# Altium schematic sheet Mikeduino Schematic Diagram.SchDoc
size A2; DocumentNumber: 6; SheetNumber: 6; SheetTotal: 6
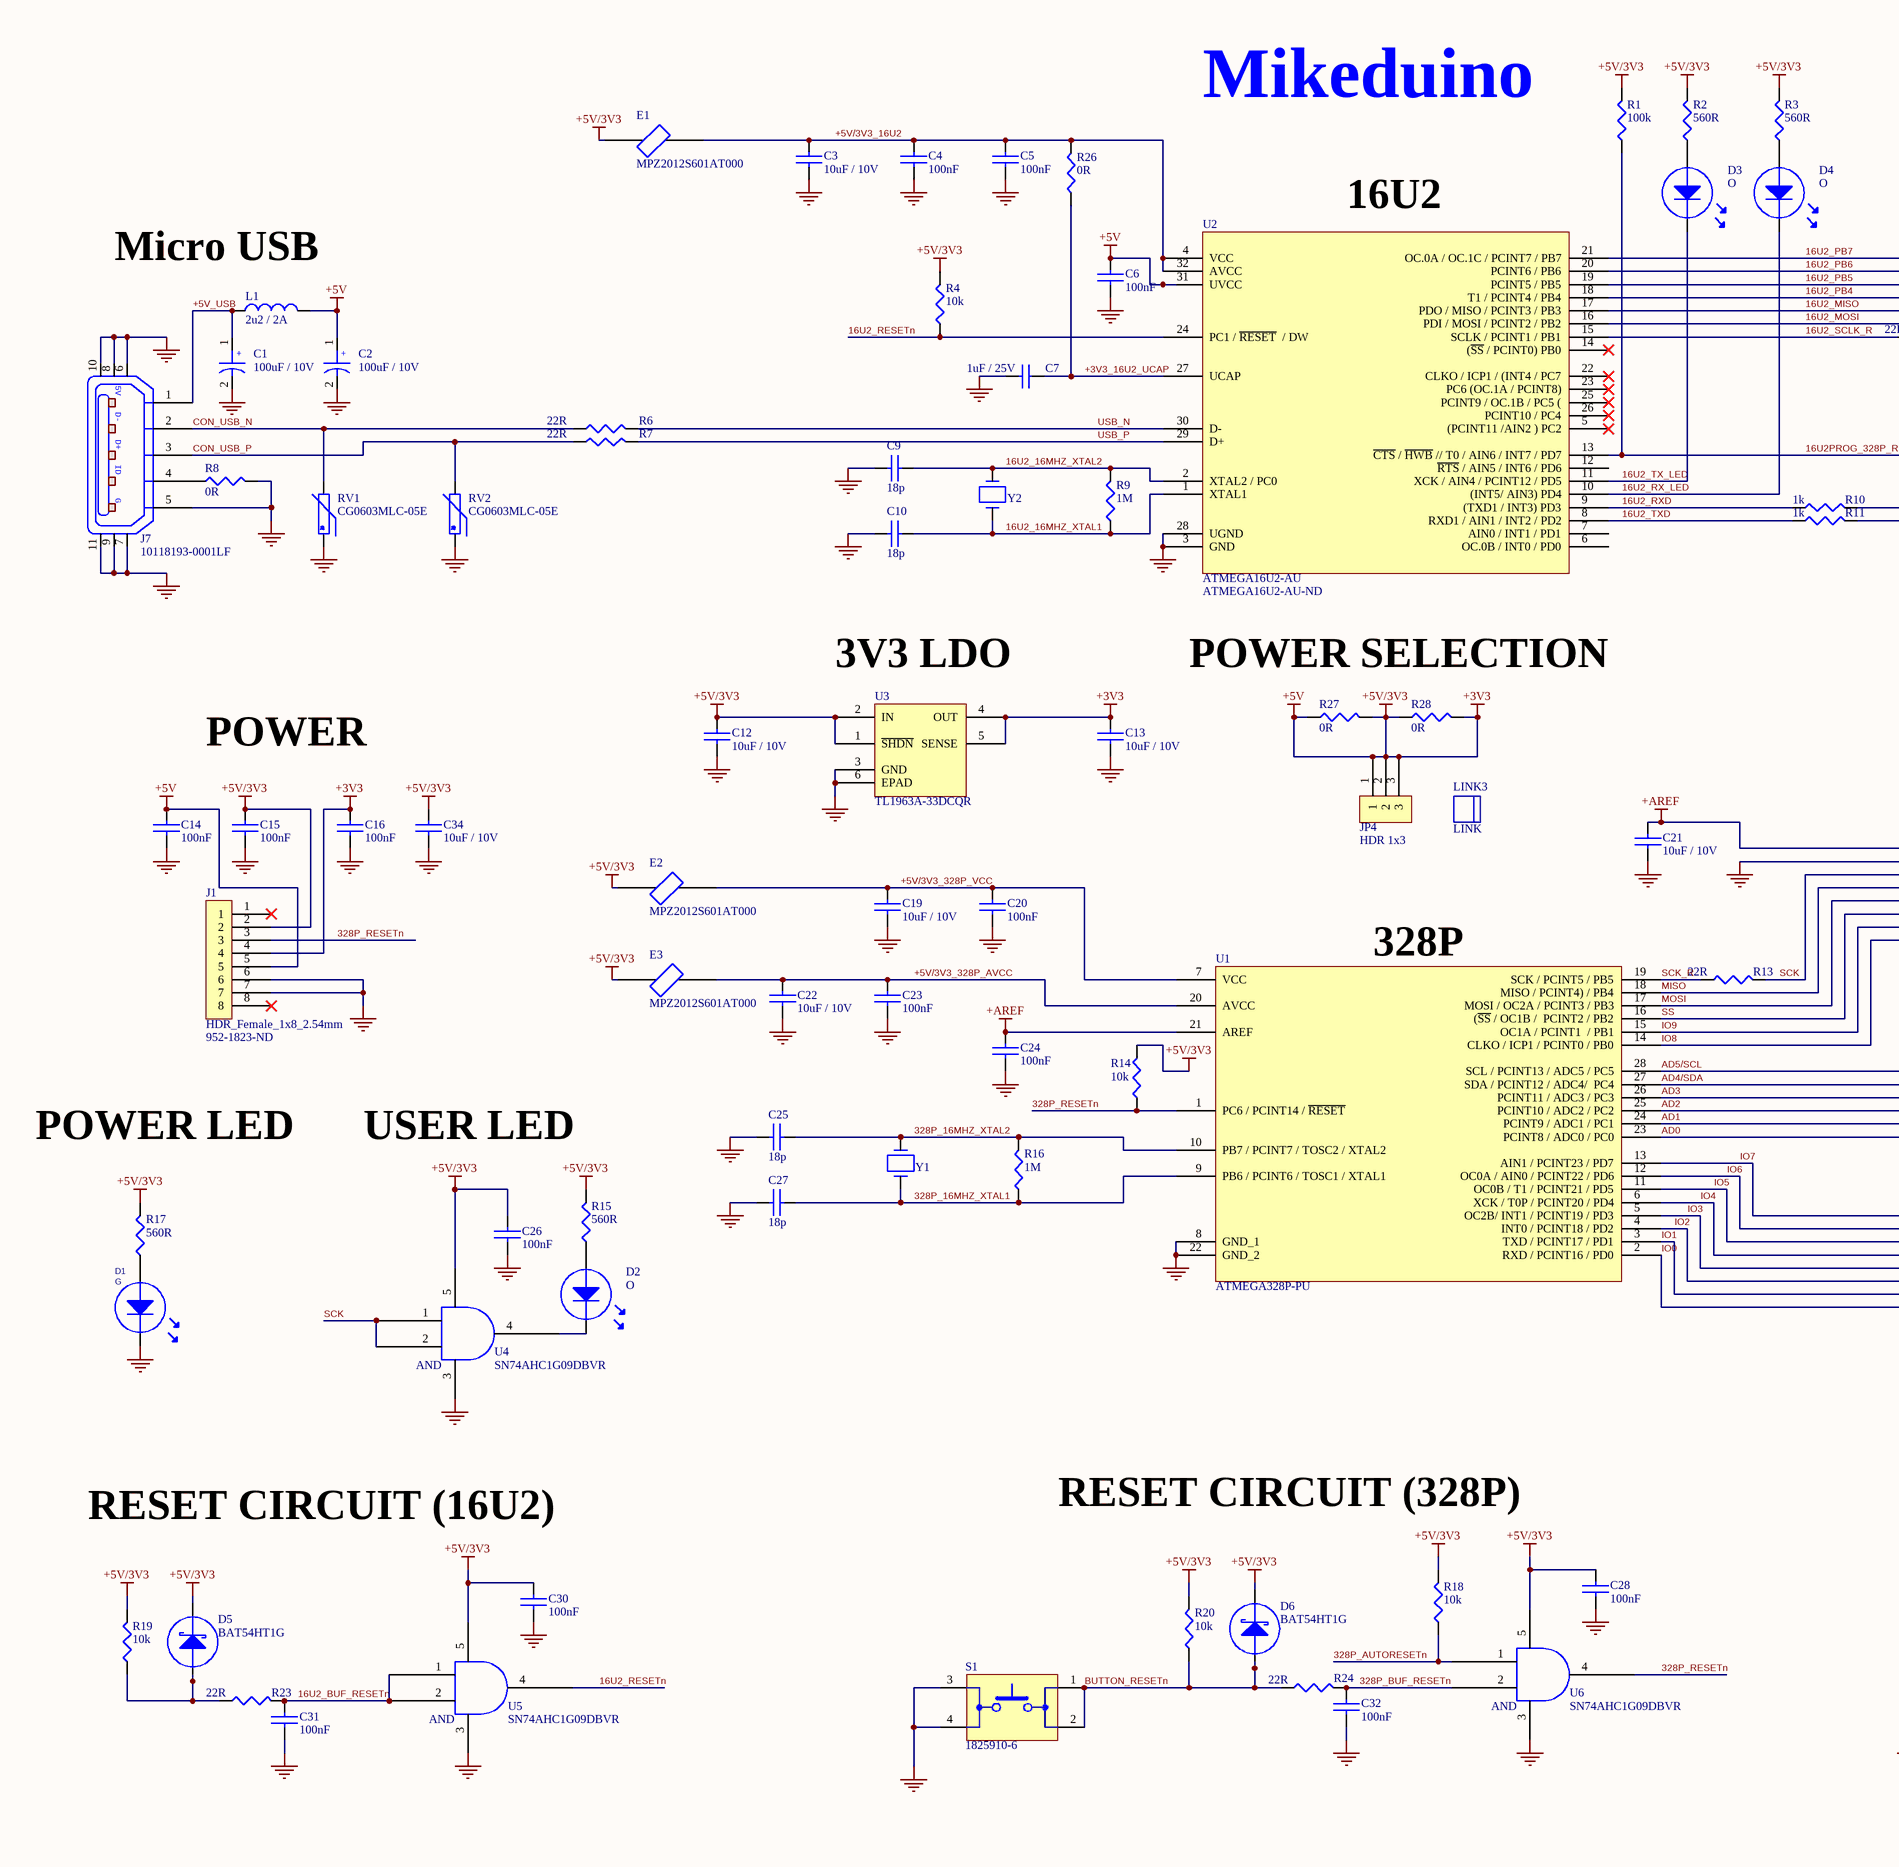
[diagram p0: Mikeduino Schematic Diagram.SchDoc, left]
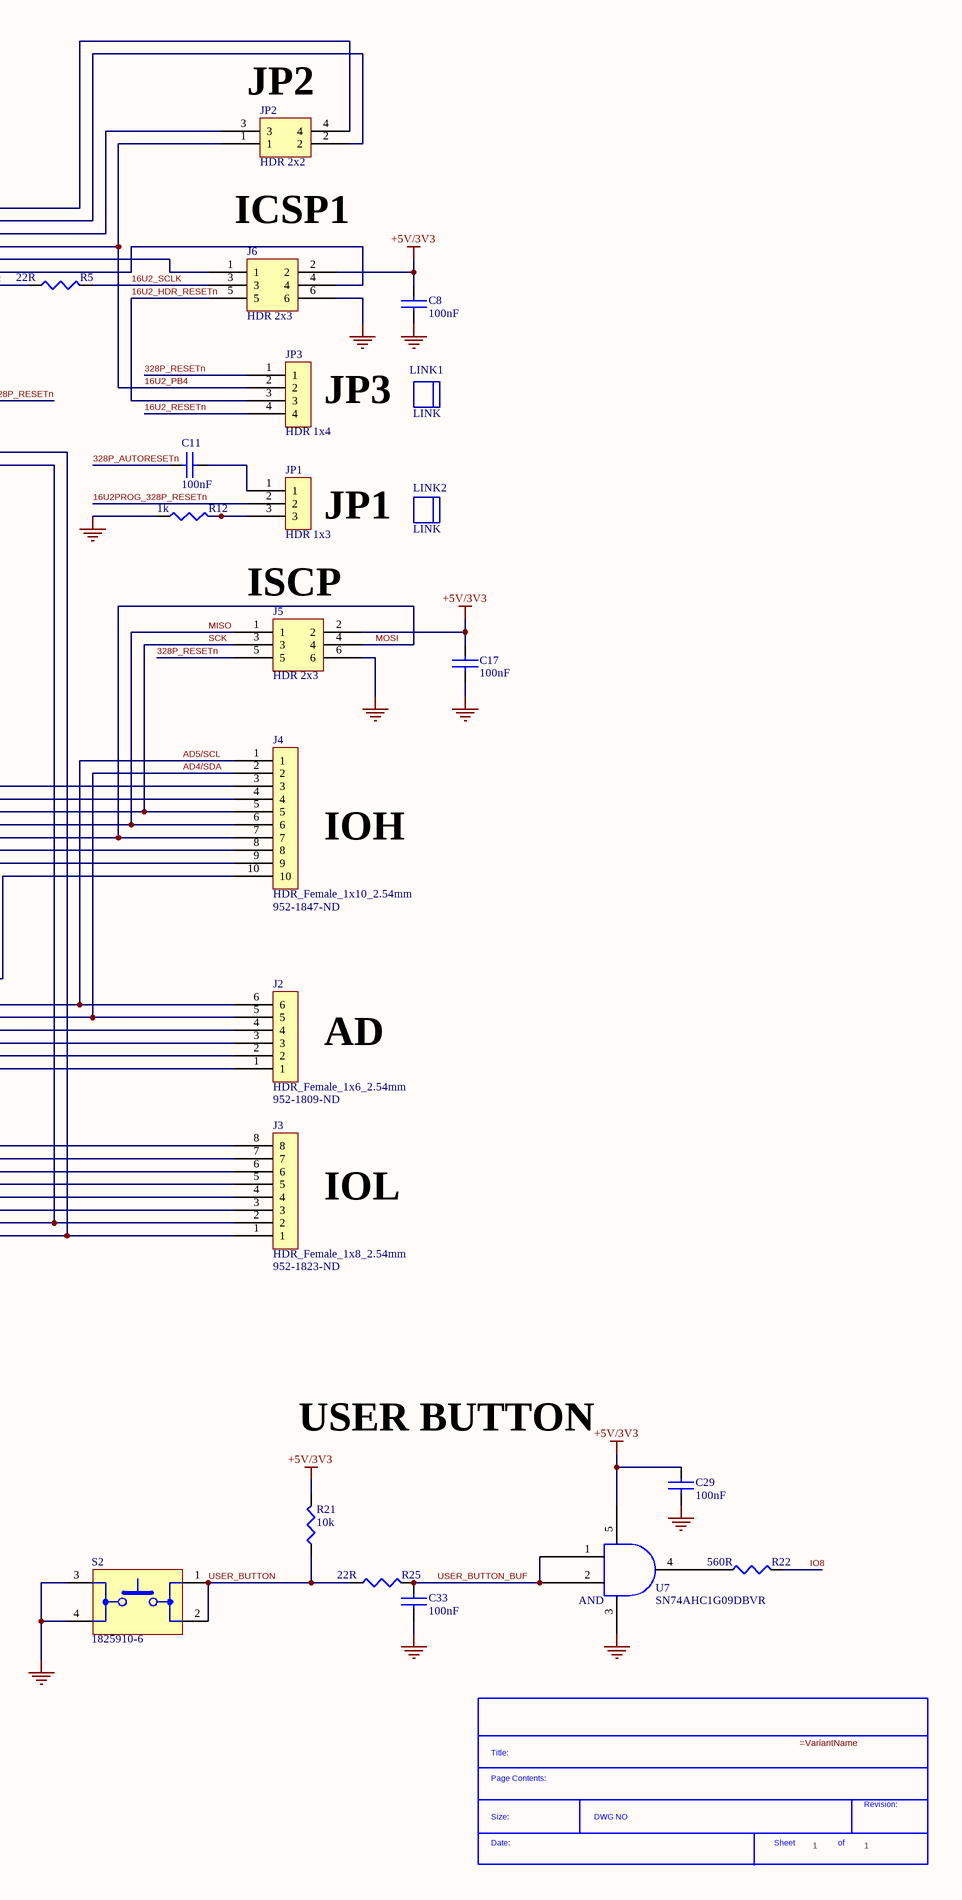
[diagram p1: Mikeduino Schematic Diagram.SchDoc, right]

## Parts
*?  SDTitleBlock  (value not drawn)  (graphical)
C1  100uF / 10V  [C_ALU]
C2  100uF / 10V  [C_ALU]
C3  10uF / 10V  [C0805]
C4  100nF  [C0805]
C5  100nF  [C0805]
C6  100nF  [C0805]
C7  1uF / 25V  [C0805]
C8  100nF  [C0805]
C9  18p  [C0805]
C10  18p  [C0805]
C11  100nF  [C0805]
C12  10uF / 10V  [C0805]
C13  10uF / 10V  [C0805]
C14  100nF  [C0805]
C15  100nF  [C0805]
C16  100nF  [C0805]
C17  100nF  [C0805]
C19  10uF / 10V  [C0805]
C20  100nF  [C0805]
C21  10uF / 10V  [C0805]
C22  10uF / 10V  [C0805]
C23  100nF  [C0805]
C24  100nF  [C0805]
C25  18p  [C0805]
C26  100nF  [C0805]
C27  18p  [C0805]
C28  100nF  [C0805]
C29  100nF  [C0805]
C30  100nF  [C0805]
C31  100nF  [C0805]
C32  100nF  [C0805]
C33  100nF  [C0805]
C34  10uF / 10V  [C0805]
D1  G  [LED_0603]
D2  O  [LED_0603]
D3  O  [LED_0603]
D4  O  [LED_0603]
D5  BAT54HT1G  [SOD323]
D6  BAT54HT1G  [SOD323]
E1  MPZ2012S601AT000  [C0805]
E2  MPZ2012S601AT000  [C0805]
E3  MPZ2012S601AT000  [C0805]
J1  HDR_Female_1x8_2.54mm  Supplier Part Number 1: 952-1823-ND  [HDR_Female_1x8_2.54mm - duplicate]
J2  HDR_Female_1x6_2.54mm  Supplier Part Number 1: 952-1809-ND  [HDR_Female_1x6_2.54mm]
J3  HDR_Female_1x8_2.54mm  Supplier Part Number 1: 952-1823-ND  [HDR_Female_1x8_2.54mm - duplicate]
J4  HDR_Female_1x10_2.54mm  Supplier Part Number 1: 952-1847-ND  [HDR_Female_1x10_2.54mm - duplicate]
J5  HDR 2x3  [HDR_2x3_2.54MM]
J6  HDR 2x3  [HDR_2x3_2.54MM]
J7  10118193-0001LF  [10118193]
JP1  HDR 1x3  [Hdr_1x3_2.54mm]
JP2  HDR 2x2  [HDR_2x2_2.54MM]
JP3  HDR 1x4  [HDR_1x4_2.54MM]
JP4  HDR 1x3  [Hdr_1x3_2.54mm]
L1  2u2 / 2A  [C1210_IND]
LINK1  LINK  (mechanical)
LINK2  LINK  (mechanical)
LINK3  LINK  (mechanical)
R1  100k  [R0805]
R2  560R  [R0805]
R3  560R  [R0805]
R4  10k  [R0805]
R5  22R  [R0805]
R6  22R  [R0805]
R7  22R  [R0805]
R8  0R  [R0805]
R9  1M  [R0805]
R10  1k  [R0805]
R11  1k  [R0805]
R12  1k  [R0805]
R13  22R  [R0805]
R14  10k  [R0805]
R15  560R  [R0805]
R16  1M  [R0805]
R17  560R  [R0805]
R18  10k  [R0805]
R19  10k  [R0805]
R20  10k  [R0805]
R21  10k  [R0805]
R22  560R  [R0805]
R23  22R  [R0805]
R24  22R  [R0805]
R25  22R  [R0805]
R26  0R  [R0805]
R27  0R  [R0805]
R28  0R  [R0805]
RV1  CG0603MLC-05E  [R0603]
RV2  CG0603MLC-05E  [R0603]
S1  1825910-6  [1825910-6]
S2  1825910-6  [1825910-6]
U1  ATMEGA328P-PU  [28PIN_DIP_7.62mm]
U2  ATMEGA16U2-AU  Supplier Part Number 1: ATMEGA16U2-AU-ND  [TQFP32]
U3  TL1963A-33DCQR  [DCQ (R-PDSO-G6)]
U4  SN74AHC1G09DBVR  [DBV_SOT_23_5]
U5  SN74AHC1G09DBVR  [DBV_SOT_23_5]
U6  SN74AHC1G09DBVR  [DBV_SOT_23_5]
U7  SN74AHC1G09DBVR  [DBV_SOT_23_5]
Y1  ABM7-22.1184MHZ-D2Y-T  [ABM7_v1_1_BIG]  (value not drawn)
Y2  ABM7-22.1184MHZ-D2Y-T  [ABM7_v1_1_BIG]  (value not drawn)

## Nets
+3V3: C2.1 C6.2 C8.2 C12.2 C13.2 C14.2 C15.2 C16.2 C17.2 C26.2 C28.2 C29.2 C30.2 C34.2 D5.1(CATHODE) D6.1(CATHODE) E1.1 E2.1 E3.1 J1.2 J1.4 J1.5 J5.2 J6.2 JP4.1 JP4.2 JP4.3 L1.2 R1.2 R2.2 R3.2 R4.2 R14.2 R15.2 R17.2 R18.2 R19.2 R20.2 R21.2 R27.1 R27.2 R28.1 R28.2 U2.31(UVCC) U3.1(~{SHDN}) U3.2(IN) U3.4(OUT) U3.5(SENSE) U4.5(VCC) U5.5(VCC) U6.5(VCC) U7.5(VCC)  [also labelled +5V, +5V/3V3]
+AREF: C21.2 C24.2 J4.3 U1.21(AREF)
GND: C1.2 C2.2 C3.1 C4.1 C5.1 C6.1 C7.2 C8.1 C9.1 C10.1 C12.1 C13.1 C14.1 C15.1 C16.1 C17.1 C19.1 C20.1 C21.1 C22.1 C23.1 C24.1 C25.1 C26.1 C27.1 C28.1 C29.1 C30.1 C31.1 C32.1 C33.1 C34.1 D1.1(cathode) J1.6 J1.7 J4.4 J5.6 J6.6 J7.5(P5) J7.6 J7.7 J7.8 J7.9 J7.10 J7.11 R8.2 R12.1 RV1.1 RV2.1 S1.3(MECH1) S1.4(MECH2) S2.3(MECH1) S2.4(MECH2) U1.8(GND_1) U1.22(GND_2) U2.3(GND) U2.28(UGND) U3.3(GND) U3.6(EPAD) U4.3(GND) U5.3(GND) U6.3(GND) U7.3(GND)
16U2_16MHZ_XTAL1: C10.2 R9.1 U2.1(XTAL1) Y2.1
16U2_16MHZ_XTAL2: C9.2 R9.2 U2.2(XTAL2_/_PC0) Y2.2
16U2_BUF_RESETn: C31.2 R23.2 U5.1(A) U5.2(B)
16U2_HDR_RESETn: J6.5 JP3.3
16U2_MISO: J6.1 U2.17(PDO_/_MISO_/_PCINT3_/_PB3)
16U2_MOSI: J6.4 U2.16(PDI_/_MOSI_/_PCINT2_/_PB2)
16U2_PB4: JP2.1 JP3.2 U2.18(T1_/_PCINT4_/_PB4)
16U2_PB5: JP2.3 U2.19(PCINT5_/_PB5)
16U2_PB6: JP2.2 U2.20(PCINT6_/_PB6)
16U2_PB7: JP2.4 U2.21(OC.0A_/_OC.1C_/_PCINT7_/_PB7)
16U2_RESETn: JP3.4 R4.1 U2.24(PC1_/_~{RESET}__/_DW) U5.4(Y)
16U2_RX_LED: D4.1(cathode) U2.10((INT5/_AIN3)_PD4)
16U2_RXD: R10.1 U2.9((TXD1_/_INT3)_PD3)
16U2_SCLK: J6.3 R5.2
16U2_SCLK_R: R5.1 U2.15(SCLK_/_PCINT1_/_PB1)
16U2_TX_LED: D3.1(cathode) U2.11(XCK_/_AIN4_/_PCINT12_/_PD5)
16U2_TXD: R11.1 U2.8(RXD1_/_AIN1_/_INT2_/_PD2)
16U2PROG_328P_RESETn: JP1.2 R1.1 U2.13(~{CTS}_/_~{HWB}_//_T0_/_AIN6_/_INT7_/_PD7)
328P_16MHZ_XTAL1: C27.2 R16.1 U1.9(PB6_/_PCINT6_/_TOSC1_/_XTAL1) Y1.1
328P_16MHZ_XTAL2: C25.2 R16.2 U1.10(PB7_/_PCINT7_/_TOSC2_/_XTAL2) Y1.2
328P_AUTORESETn: C11.1 R18.1 U6.1(A)
328P_BUF_RESETn: C32.2 R24.2 U6.2(B)
328P_RESETn: J1.3 J5.5 JP3.1 R14.1 U1.1(PC6_/_PCINT14_/_~{RESET}) U6.4(Y)
+3V3_16U2_UCAP: C7.1 R26.1 U2.27(UCAP)
+5V/3V3_16U2: C3.2 C4.2 C5.2 E1.2 R26.2 U2.4(VCC) U2.32(AVCC)
+5V/3V3_328P_AVCC: C22.2 C23.2 E3.2 U1.20(AVCC)
+5V/3V3_328P_VCC: C19.2 C20.2 E2.2 U1.7(VCC)
+5V_USB: C1.1 J7.1(P1) L1.1
AD0: J2.1 U1.23(PCINT8_/_ADC0_/_PC0)
AD1: J2.2 U1.24(PCINT9_/_ADC1_/_PC1)
AD2: J2.3 U1.25(PCINT10_/_ADC2_/_PC2)
AD3: J2.4 U1.26(PCINT11_/_ADC3_/_PC3)
AD4/SDA: J2.5 J4.2 U1.27(SDA_/_PCINT12_/_ADC4/__PC4)
AD5/SCL: J2.6 J4.1 U1.28(SCL_/_PCINT13_/_ADC5_/_PC5)
BUTTON_RESETn: D6.2(ANODE) R20.1 R24.1 S1.1 S1.2
CON_USB_N: J7.2(P2) R6.1 RV1.2
CON_USB_P: J7.3(P3) R7.1 RV2.2
IO0: J3.1 R10.2 U1.2(RXD_/_PCINT16_/_PD0)
IO1: J3.2 R11.2 U1.3(TXD_/_PCINT17_/_PD1)
IO2: J3.3 U1.4(INT0_/_PCINT18_/_PD2)
IO3: J3.4 U1.5(OC2B/_INT1_/_PCINT19_/_PD3)
IO4: J3.5 U1.6(XCK_/_T0P_/_PCINT20_/_PD4)
IO5: J3.6 U1.11(OC0B_/_T1_/_PCINT21_/_PD5)
IO6: J3.7 U1.12(OC0A_/_AIN0_/_PCINT22_/_PD6)
IO7: J3.8 U1.13(AIN1_/_PCINT23_/_PD7)
IO8: J4.10 R22.2 U1.14(CLKO_/_ICP1_/_PCINT0_/_PB0)
IO9: J4.9 U1.15(OC1A_/_PCINT1__/_PB1)
MISO: J4.6 J5.1 U1.18(MISO_/_PCINT4)_/_PB4)
MOSI: J4.7 J5.4 U1.17(MOSI_/_OC2A_/_PCINT3_/_PB3)
SCK: J4.5 J5.3 R13.2 U4.1(A) U4.2(B)
SCK_R: R13.1 U1.19(SCK_/_PCINT5_/_PB5)
SS: J4.8 U1.16((~{SS}_/_OC1B_/__PCINT2_/_PB2)
USB_N: R6.2 U2.30(D-)
USB_P: R7.2 U2.29(D+)
USER_BUTTON: R21.1 R25.1 S2.1 S2.2
USER_BUTTON_BUF: C33.2 R25.2 U7.1(A) U7.2(B)
NetC11_2: C11.2 JP1.1
NetD1_2: D1.2(ANODE) R17.1
NetD2_1: D2.1(cathode) U4.4(Y)
NetD2_2: D2.2(ANODE) R15.1
NetD3_2: D3.2(ANODE) R2.1
NetD4_2: D4.2(ANODE) R3.1
NetD5_2: D5.2(ANODE) R19.1 R23.1
NetJ7_4: J7.4(P4) R8.1
NetJP1_3: JP1.3 R12.2
NetR22_1: R22.1 U7.4(Y)

Not connected (* = marked no-connect by the designer): J1 1* 8*; U2 5((PCINT11_/AIN2_)_PC2)* 6(OC.0B_/_INT0_/_PD0) 7(AIN0_/_INT1_/_PD1) 12(~{RTS}_/_AIN5_/_INT6_/_PD6) 14((~{SS}_/_PCINT0)_PB0)* 22(CLKO_/_ICP1_/_(INT4_/_PC7)* 23(PC6_(OC.1A_/_PCINT8))* 25(PCINT9_/_OC.1B_/_PC5_()* 26(PCINT10_/_PC4)*

## Notes on the sheet
- Mikeduino
- (near JP2) JP2
- (near U2) 16U2
- (near L1) Micro USB
- ICSP1
- JP3
- JP1
- (near U3) 3V3 LDO
- POWER SELECTION
- (near J5) ISCP
- POWER
- (near U1) 328P
- IOH
- POWER LED
- USER LED
- AD
- IOL
- RESET CIRCUIT (16U2)
- RESET CIRCUIT (328P)
- USER BUTTON
- Labels drawn without touching a wire or pin: 1, =VariantName
- (in symbol 10118193-0001LF) 5V; D-; D+; ID; G
- (in symbol EEA-GA1A101B) +
- (in symbol SDTitleBlock) Title:; Page Contents:; Revision:; Size:; DWG NO; Date:; Sheet; of
- (in symbol SN74AHC1G09DBVR) AND

## Library data of the parts
C1 C2 = EEA-GA1A101B: CAP ALUM 100UF 20% 10V RADIAL; Manufacturer: Panasonic; Ripple Current: 110mA; Life (Hours): 1000Hour; Leakage Current: 10uA; Supplier 1: Digi-Key; Manufacturer Part Number 1: EEA-GA1A101B; Description 1: CAP ALUM 100UF 20% 10V RADIAL; Stock 1: 5678; Pricing 1: 1=0.35, 10=0.238, 100=0.1347, 500=0.0951, 1000=0.0832 (USD); Mount: Through Hole; Case/Package: Radial; Contact Plating: Tin; Min Operating Temperature: -55°C; Max Operating Temperature: 105°C; Package Quantity: 1; Capacitance: 100uF; Tolerance: 20%; Packaging: Tape and Reel; Voltage Rating: 10V; Voltage Rating (DC): 10V; Termination: Radial; Features: General Purpose; Diameter: 6.3mm; Length: 7mm; Height: 7mm; Lead Pitch: 5mm; Height - Seated (Max): 0.276inch; Radiation Hardening: No; Supplier Part Number 1: P15782CT-ND
C3 C12 C13 C19 C21 C22 C34 = CL21A106KPCLQNC: Cap Ceramic 10uF 10V X5R 10% SMD 0805 85C Cardboard T/R; Manufacturer: Samsung; Supplier 1: Digi-Key; Manufacturer Part Number: CL21A106KPCLQNC; Stock 1: 40000; Pricing 1: 1=0.23, 10=0.16, 100=0.0811, 500=0.0555, 1000=0.0491 (USD); Mount: Surface Mount; Case/Package: 0805; Case Code (Metric): 2012; Case Code (Imperial): 0805; Contact Plating: Tin; Min Operating Temperature: -55°C; Max Operating Temperature: 85°C; Tolerance: 10%; Capacitance: 10uF; Dielectric: X5R; Packaging: Tape and Reel; Package Quantity: 1; Voltage Rating: 10V; Length: 2mm; Height: 0.85mm; Depth: 1.25mm; Width: 0.049inch; Thickness: 0.037inch; Radiation Hardening: No; Supplier Part Number 1: 1276-2402-6-ND
C4-C6 C8 C11 C14-C17 C20 C23 C24 C26 C28-C33 = CEU4J2X7R1H104K125AE: TDK         CEU4J2X7R1H104K125AE             SMD Multilayer Ceramic Capacitor, 0805 [2012 Metric], 0.1 F, 50 V,  10%, X7R, CEU Series; Voltage Rating: 50V; Supplier 1: Digi-Key; Manufacturer: TDK; Manufacturer Part Number: CEU4J2X7R1H104K125AE; Stock 1: 0; Pricing 1: 2000=0.108 (USD); Mount: Surface Mount; Case/Package: 0805; Weight: 0.000194oz; Case Code (Imperial): 0805; Case Code (Metric): 2012; Min Operating Temperature: -55°C; Max Operating Temperature: 125°C; Capacitance: 100nF; Tolerance: 10%; Packaging: Tape and Reel; Dielectric: X7R; Termination: SMD/SMT; Voltage Rating (DC): 50V; Package Quantity: 1; Composition: Ceramic; Length: 2mm; Width: 1.2mm; Thickness: 0.057inch; Depth: 1.25mm; REACH SVHC: No SVHC; ComponentLink1URL: https://datasheet.ciiva.com/24219/ceu4j2x7r1h104k125ae-265602-24219969.pdf; ComponentLink1Description: https://datasheet.ciiva.com/24219/ceu4j2x7r1h104k125ae-265602-24219969.pdf; ComponentLink2URL: https://datasheet.ciiva.com/6257/tdk-tj-car-e-0711-6257705.pdf; ComponentLink2Description: https://datasheet.ciiva.com/6257/tdk-tj-car-e-0711-6257705.pdf; ComponentLink3URL: https://datasheet.ciiva.com/6257/tdk-tj-car-e-0711-6257707.pdf; ComponentLink3Description: https://datasheet.ciiva.com/6257/tdk-tj-car-e-0711-6257707.pdf; ComponentLink4URL: https://datasheet.ciiva.com/6257/tdk-tj-car-e-0711-6257710.pdf; ComponentLink4Description: https://datasheet.ciiva.com/6257/tdk-tj-car-e-0711-6257710.pdf; Supplier Part Number 1: 445-7856-2-ND
C7 = C2012X5R1E105K125AA: CAP CER 1UF 25V 10% X5R 0805; Manufacturer: TDK Corporation; Capacitance: 1µF; .Creator: MM; .Checked PCB: RF; Supplier 1: Digi-Key; Manufacturer Part Number: C2012X5R1E105K125AA; RoHS: RoHS Compliant; Category: Capacitors; Stock 1: 57052; Pricing 1: 1=0.16, 10=0.112, 100=0.0533, 250=0.04488, 500=0.03758, 1000=0.03025 (USD); Packaging: Cut Tape (CT); Tolerance: ±10%; Voltage - Rated: 25V; Temperature Coefficient: X5R; Mounting Type: Surface Mount, MLCC; Operating Temperature: -55°C ~ 85°C; Applications: General Purpose; Ratings: -; Package / Case: 0805 (2012 Metric); Size / Dimension: 0.079" L x 0.049" W (2.00mm x 1.25mm); Height - Seated (Max): -; Thickness (Max): 0.057" (1.45mm); Lead Spacing: -; Features: -; Lead Style: -; ComponentLink1URL: http://product.tdk.com/en/catalog/datasheets/mlcc_commercial_general_en.pdf; ComponentLink1Description: http://product.tdk.com/en/catalog/datasheets/mlcc_commercial_general_en.pdf; Supplier Part Number 1: 445-1419-1-ND; .Checked SCH: RF
C9 C10 C25 C27 = C0805C180J5GAC7800: KEMET 18pF Multilayer Ceramic Capacitor (MLCC) 50 V dc 5% C0G dielectric C SMD max op. temp. +125C; Voltage: 50V; Temperature Coefficient: 30ppm/°C; Supplier 1: Digi-Key; Manufacturer: KEMET; Manufacturer Part Number 1: C0805C180J5GAC7800; Description 1: KEMET 18pF Multilayer Ceramic Capacitor (MLCC) 50 V dc 5% C0G dielectric C SMD max op. temp. +125C; Stock 1: 0; Pricing 1: 1=0.16, 10=0.113, 100=0.0532, 500=0.0373, 1000=0.0309 (USD); Mount: Surface Mount; Case/Package: 0805; Dielectric Material: Ceramic; Contact Plating: Matte,Tin; Min Operating Temperature: -55°C; Max Operating Temperature: 125°C; Tolerance: 5%; Capacitance: 18pF; Packaging: Tape and Reel; Dielectric: C0G; Termination: SMD/SMT; Voltage Rating (DC): 50V; Length: 2mm; Height: 0.78mm; Depth: 1.25mm; Radiation Hardening: No; Lead Free: Lead Free; Supplier Part Number 1: 399-1112-6-ND
D1 = LG L29K-G2J1-24-Z: LED SMARTLED GREEN 570NM 0603; Manufacturer: OSRAM Opto Semiconductors Inc; .Checked PCB: used; Current - Test: 2mA; Voltage - Forward (Vf) Typ: 1.7V; Luminous Flux @ Current - Test: 12 mlm; Millicandela Rating: 3.92mcd; Wavelength - Peak: 572nm; Lens Type: Diffused; Lens Style/Size: Rectangle with Flat Top, 1.3mm x 0.8mm; Viewing Angle: 160°; Regulator Topology: Positive Fixed; Voltage - Output: 2.5V; Voltage - Input: 2.6 V ~ 6 V; Voltage - Dropout (Typical): 0.16V @ 500mA; Number of Regulators: 1; Current - Output: 500mA; Current - Limit (Min): 600mA; .Checked SCH: used; Category: Optoelectronics; Supplier Part Number: 475-2709-1-ND; Family: LEDs - <75mA, Discre; Manufacturer Part Number: LG L29K-G2J1-24-Z; Price 1k [$]: 0.08744; Value: Green; Color: Green; Package / Case: 0603 (1608 Metric); Supplier: Digikey; Supplier 1: Digi-Key; Supplier Part Number 1: 475-2709-1-ND; RoHS: RoHS Compliant; Stock 1: 30318; Pricing 1: 1=0.16, 10=0.137, 100=0.1093, 250=0.09564, 500=0.08744 (USD); Wavelength - Dominant: 570nm; Size / Dimension: 1.70mm L x 0.80mm W; Height: 0.65mm; Mounting Type: Surface Mount; Packaging: Cut Tape (CT); ComponentLink1URL: http://catalog.osram-os.com/catalogue/catalogue.do;jsessionid=32CB61882C089EDD4B6D0A54E7E1F117?act=downloadFile&favOid=020000020000138e000100b6; ComponentLink1Description: http://catalog.osram-os.com/catalogue/catalogue.do;jsessionid=32CB61882C089EDD4B6D0A54E7E1F117?act=downloadFile&favOid=020000020000138e000100b6; Operating Temperature: -40°C ~ 125°C; Supplier Device Package: 6-TMLF® (1.6x1.6); ComponentLink2URL: http://www.micrel.com/_PDF/mic5353.pdf; ComponentLink2Description: http://www.micrel.com/_PDF/mic5353.pdf
D2-D4 = LO L29K-H2K1-24-Z: LED SMARTLED ORANGE 606NM 0603; Manufacturer: OSRAM Opto Semiconductors Inc; Millicandela Rating: 6.3mcd; Voltage - Forward (Vf) Typ: 1.8V; Current - Test: 2mA; Wavelength - Peak: 610nm; Viewing Angle: 160°; Lens Type: Diffused; Lens Style/Size: Rectangle with Flat Top, 1.3mm x 0.8mm; Luminous Flux @ Current - Test: 25 mlm; .Checked PCB: used; Supplier 1: Digi-Key; Supplier Part Number 1: 475-2740-1-ND; Manufacturer Part Number: LO L29K-H2K1-24-Z; RoHS: RoHS Compliant; Category: Optoelectronics; Stock 1: 15900; Pricing 1: 1=0.17, 10=0.141, 100=0.1127, 250=0.0986, 500=0.09016 (USD); Color: Orange; Wavelength - Dominant: 606nm; Package / Case: 0603 (1608 Metric); Size / Dimension: 1.70mm L x 0.80mm W; Height: 0.65mm; Mounting Type: Surface Mount; Packaging: Cut Tape (CT); ComponentLink1URL: http://catalog.osram-os.com/catalogue/catalogue.do;jsessionid=302CF83AF637AE24E40AEB0ADA267EDD?act=downloadFile&favOid=020000010003f9de000100b6; ComponentLink1Description: http://catalog.osram-os.com/catalogue/catalogue.do;jsessionid=302CF83AF637AE24E40AEB0ADA267EDD?act=downloadFile&favOid=020000010003f9de000100b6; .Checked SCH: used
D5 D6 = BAT54HT1G: DIODE SCHOTTKY 30V 0.2A SOD323; Manufacturer: Fairchild Semiconductor; Current - Average Rectified (Io): 200mA; Voltage - Forward (Vf) (Max) @ If: 800mV @ 100mA; Speed: Small Signal =< 200mA (Io), Any Speed; Reverse Recovery Time (trr): 5ns; Current - Reverse Leakage @ Vr: 2µA @ 25V; Capacitance @ Vr, F: 10pF @ 1V, 1MHz; Thermal Resistance: 600°C/W Ja; .Creator: MM; .Checked PCB: used; Supplier 1: Digi-Key; Manufacturer Part Number: BAT54HT1G; RoHS: RoHS Compliant; Category: Discrete Semiconductor Products; Stock 1: 11388; Pricing 1: 1=0.3, 10=0.276, 25=0.1984, 100=0.1543, 250=0.09696, 500=0.0826, 1000=0.05628 (USD); Packaging: Cut Tape (CT); Diode Type: Schottky; Voltage - DC Reverse (Vr) (Max): 30V; Mounting Type: Surface Mount; Package / Case: SC-76, SOD-323; Supplier Device Package: SOD-323; Operating Temperature - Junction: -55°C ~ 150°C; ComponentLink1URL: http://www.fairchildsemi.com/ds/BA/BAT54HT1G.pdf; ComponentLink1Description: http://www.fairchildsemi.com/ds/BA/BAT54HT1G.pdf; Supplier Part Number 1: BAT54HT1GCT-ND; .Checked SCH: used
E1-E3 = MPZ2012S601AT000: TDK   MPZ2012S601AT000   FERRITE BEAD, 0.1OHM, 2A, 0805, FULL REEL; Impedance: 600R; DC Resistance (DCR): 100mR; Supplier 1: Digi-Key; Manufacturer: TDK; Manufacturer Part Number: MPZ2012S601AT000; Stock 1: 326529; Pricing 1: 1=0.11, 10=0.091, 25=0.0704, 50=0.0584, 100=0.0503, 250=0.0403, 500=0.0362, 1000=0.0302 (USD); Mount: Surface Mount; Case/Package: 0805; Case Code (Metric): 2012; Case Code (Imperial): 0805; Packaging: Tape and Reel; Package Quantity: 1; Current Rating: 2A; Max DC Current: 2A; Length: 0.079inch; Height: 0.041inch; Width: 0.049inch; REACH SVHC: No SVHC; Lead Free: Lead Free; Supplier Part Number 1: 445-2206-6-ND
J1 J3 = M20-7820842: Headers & Wire Housings 8 PIN SIL VERTICAL SOCKET GOLD+TIN; Manufacturer: Harwin; Number of Contacts: 8; Max Current Rating: 3A; Contact Resistance: 20mR; Connector Type: Receptacle,Socket; Gender: Female; Pitch: 2.54mm; Supplier 1: Digi-Key; Manufacturer Part Number: M20-7820842; Stock 1: 1833; Pricing 1: 1=1.1, 10=0.972, 100=0.8382, 500=0.6858, 1000=0.6096, 5000=0.5334, 10000=0.5067 (USD); Mount: Through Hole; Case/Package: SIL; Weight: 0.025397oz; Contact Plating: Tin,Gold; Colour: Black; Contact Material: Bronze; Housing Colour: Black; Housing Material: Polyamide; Min Operating Temperature: -40°C; Max Operating Temperature: 105°C; Number of Rows: 1; Termination: Solder; Contact Gender: Female; Package Quantity: 29; Packaging: Rail/Tube; Number of Positions: 8; Orientation: Straight; Length: 20.72mm; Depth: 2.5mm; Radiation Hardening: No; ComponentLink1URL: https://datasheet.ciiva.com/16732/m20-782-16732663.pdf; ComponentLink1Description: https://datasheet.ciiva.com/16732/m20-782-16732663.pdf; ComponentLink2URL: https://datasheet.ciiva.com/9480/m20-782-9480074.pdf; ComponentLink2Description: https://datasheet.ciiva.com/9480/m20-782-9480074.pdf
J2 = M20-7820646: Headers & Wire Housings 6 PIN SIL VERTICAL SOCKET TIN; Manufacturer: Harwin; Number of Contacts: 6; Max Current Rating: 3A; Contact Resistance: 20mR; Connector Type: Receptacle,Socket; Gender: Female; Pitch: 2.54mm; Supplier 1: Digi-Key; Manufacturer Part Number: M20-7820646; Stock 1: 3680; Pricing 1: 1=0.96, 10=0.842, 100=0.726, 500=0.594, 1000=0.528, 5000=0.462, 10000=0.4389 (USD); Mount: Through Hole; Case/Package: SIL; Colour: Black; Contact Plating: Tin; Contact Material: Bronze; Housing Colour: Black; Housing Material: Nylon; Min Operating Temperature: -40°C; Max Operating Temperature: 105°C; Number of Rows: 1; Termination: Solder; Packaging: Rail/Tube; Contact Gender: Female; Package Quantity: 38; Number of Positions: 6; Orientation: Straight; Length: 15.64mm; Depth: 2.5mm; Radiation Hardening: No; ComponentLink1URL: http://www.harwin.com/include/downloads/pdfs/2010PAGE120.PDF; ComponentLink1Description: http://www.harwin.com/include/downloads/pdfs/2010PAGE120.PDF; ComponentLink2URL: https://cdn.harwin.com/pdfs/Harwin_PC_Connectors_M20.pdf; ComponentLink2Description: https://cdn.harwin.com/pdfs/Harwin_PC_Connectors_M20.pdf; ComponentLink3URL: http://components.arrow.com/part/dataview/0323_00725884; ComponentLink3Description: http://components.arrow.com/part/dataview/0323_00725884
J4 = M20-7821046: Headers & Wire Housings 10 PIN SIL VERTICAL SOCKET TIN; Manufacturer: Harwin; Number of Contacts: 10; Max Current Rating: 3A; Contact Resistance: 20mR; Mating Cycles: 50; Connector Type: Receptacle,Socket; Gender: Receptacle; Insulation Resistance: 1MR; Pitch: 2.54mm; Hole Diameter: 0.8mm; Supplier 1: Digi-Key; Manufacturer Part Number: M20-7821046; Stock 1: 339; Pricing 1: 1=1.28, 10=1.122, 100=0.968, 500=0.792, 1000=0.704, 5000=0.616, 10000=0.5852 (USD); Mount: Through Hole; Case/Package: SIL; Colour: Black; Contact Plating: Tin; Contact Material: Bronze; Housing Colour: Black; Housing Material: Polyamide; Min Operating Temperature: -40°C; Max Operating Temperature: 105°C; Number of Rows: 1; Termination: Solder; Packaging: Rail/Tube; Contact Gender: Female; Package Quantity: 23; Current Rating: 3A; Number of Positions: 10; Orientation: Straight; Length: 25.8mm; Lead Pitch: 2.54mm; Depth: 2.5mm; Radiation Hardening: No; REACH SVHC: No SVHC; ComponentLink1URL: https://datasheet.ciiva.com/26899/getdatasheetpartid-559226-26899379.pdf; ComponentLink1Description: https://datasheet.ciiva.com/26899/getdatasheetpartid-559226-26899379.pdf; ComponentLink2URL: https://datasheet.ciiva.com/6785/m20-782-6785605.pdf; ComponentLink2Description: https://datasheet.ciiva.com/6785/m20-782-6785605.pdf; ComponentLink3URL: https://datasheet.ciiva.com/10151/m20-782-10151366.pdf; ComponentLink3Description: https://datasheet.ciiva.com/10151/m20-782-10151366.pdf; ComponentLink4URL: https://datasheet.ciiva.com/16732/m20-782-16732152.pdf; ComponentLink4Description: https://datasheet.ciiva.com/16732/m20-782-16732152.pdf; ComponentLink5URL: https://datasheet.ciiva.com/11753/0900766b80dc1d2b-11753869.pdf; ComponentLink5Description: https://datasheet.ciiva.com/11753/0900766b80dc1d2b-11753869.pdf
J5 J6 = 67997-206HLF: 6 Positions Header, Unshrouded Connector 0.100" (2.54mm) Through Hole Gold or Gold, GXT™; Manufacturer: Amphenol FCI; Current Rating: 3A; Voltage Rating: 1.5kV; Number of Positions: 6; Insulation Resistance: 5GR; Gender: Male; Connector Type: Male Pin; Mating Post Length: 5.84mm; Row Spacing: 0.1inch; Supplier 1: Digi-Key; Manufacturer Part Number 1: 67997-206HLF; Description 1: 6 Positions Header, Unshrouded Connector 0.100" (2.54mm) Through Hole Gold or Gold, GXT™; Stock 1: 15115; Pricing 1: 1=0.32, 10=0.307, 100=0.2146, 500=0.184, 1000=0.1533, 5000=0.1314, 10000=0.1226 (USD); Mount: Through Hole; Contact Plating: Gold,GXT; Contact Material: Bronze; Colour: Black; Housing Colour: Black; Housing Material: Thermoplastic; Min Operating Temperature: -65°C; Max Operating Temperature: 125°C; Number of Rows: 2; Contact Gender: Male; Packaging: Bulk; Package Quantity: 100; Termination: Solder; Max Voltage Rating (AC): 1.5kV; Number of Contacts: 6; Orientation: Straight; Length: 7.62mm; Pitch: 2.54mm; Termination Post Length: 3.05mm; Contact Mating Length: 0.23inch; Depth: 4.83mm; Radiation Hardening: No; Flammability Rating: UL94 V-0; Supplier Part Number 1: 609-3234-ND
J7 = 10118193-0001LF: CONN USB MICRO B RECPT SMT R/A; Manufacturer: FCI; Connector Type: USB - micro B; Number of Contacts: 5; Gender: Receptacle; Specifications: USB 2.0; .Creator: MM; .Checked PCB: RF; Supplier 1: Digi-Key; Manufacturer Part Number: 10118193-0001LF; RoHS: RoHS Compliant; Category: Connectors, Interconnects; Stock 1: 28642; Pricing 1: 1=0.46, 10=0.433, 25=0.3712, 50=0.3156, 100=0.3032, 250=0.27224, 500=0.25988 (USD); Packaging: Cut Tape (CT); Mounting Type: Surface Mount, Right Angle, Horizontal; Features: Shielded, Solder Retention; Ingress Protection: -; ComponentLink1URL: http://portal.fciconnect.com/Comergent//fci/drawing/10118193.pdf; ComponentLink1Description: http://portal.fciconnect.com/Comergent//fci/drawing/10118193.pdf; Supplier Part Number 1: 609-4616-1-ND; .Checked SCH: MM
JP1 JP4 = 68000-103HLF: BERGSTIK II .100" SR STRAIGHT; Manufacturer: FCI; Connector Type: Header, Unshrouded; Number of Positions: 3; Number of Positions Loaded: All; Pitch: 0.100" (2.54mm); .Creator: MM; .Checked PCB: used; Supplier 1: Digi-Key; Manufacturer Part Number: 68000-103HLF; RoHS: RoHS Compliant; Category: Connectors, Interconnects; Stock 1: 37214; Pricing 1: 1=0.15, 10=0.145, 25=0.108, 50=0.0924 (USD); Packaging: Bulk; Contact Type: Male Pin; Number of Rows: 1; Row Spacing: -; Contact Mating Length: 0.230" (5.84mm); Mounting Type: Through Hole; Termination: Solder; Fastening Type: -; Features: -; Contact Finish: Gold or Gold, GXT™; Contact Finish Thickness: 30µin (0.76µm); Color: Black; ComponentLink1URL: http://portal.fciconnect.com/Comergent//fci/drawing/68000.pdf; ComponentLink1Description: http://portal.fciconnect.com/Comergent//fci/drawing/68000.pdf; Supplier Part Number 1: 609-3461-ND; .Checked SCH: used
JP2 = 68602-204HLF: CONN HEADER 4POS .100 STR 15AU; Manufacturer: FCI; Connector Type: Header, Unshrouded; Number of Positions: 4; Number of Positions Loaded: All; Pitch: 0.100" (2.54mm); .Creator: MM; .Checked PCB: RF; Supplier 1: Digi-Key; Manufacturer Part Number: 68602-204HLF; RoHS: RoHS Compliant; Category: Connectors, Interconnects; Stock 1: 2795; Pricing 1: 1=0.34, 10=0.326, 25=0.2792, 50=0.2374, 100=0.2281, 250=0.20484, 500=0.19552, 1000=0.16293, 2500=0.14896 (USD); Packaging: Bulk; Contact Type: Male Pin; Number of Rows: 2; Row Spacing: 0.100" (2.54mm); Contact Mating Length: 0.230" (5.84mm); Mounting Type: Through Hole; Termination: Solder; Fastening Type: -; Features: -; Contact Finish: Gold or Gold, GXT™; Contact Finish Thickness: 15µin (0.38µm); Color: Black; ComponentLink1URL: http://portal.fciconnect.com/Comergent//fci/drawing/67996.pdf; ComponentLink1Description: http://portal.fciconnect.com/Comergent//fci/drawing/67996.pdf; Supplier Part Number 1: 609-3369-ND; .Checked SCH: RF
JP3 = 68001-204HLF: CONN HEADER 4POS .100 STR 15AU; Manufacturer: FCI; Connector Type: Header, Unshrouded; Number of Positions: 4; Number of Positions Loaded: All; Pitch: 0.100" (2.54mm); .Checked PCB: RF; Supplier 1: Digi-Key; Supplier Part Number 1: 609-3402-ND; Manufacturer Part Number: 68001-204HLF; RoHS: RoHS Compliant; Category: Connectors, Interconnects; Stock 1: 8754; Pricing 1: 1=0.7, 10=0.432, 100=0.2485, 250=0.21868, 500=0.1988, 1000=0.17892, 5000=0.12674 (USD); Contact Type: Male Pin; Number of Rows: 1; Row Spacing: -; Contact Mating Length: 0.230" (5.84mm); Mounting Type: Through Hole; Termination: Solder; Fastening Type: -; Features: -; Contact Finish: Gold; Contact Finish Thickness: 15µin (0.38µm); Color: Black; Packaging: Bulk; ComponentLink1URL: http://portal.fciconnect.com/res/en/pdffiles/doc_search/68000.pdf; ComponentLink1Description: http://portal.fciconnect.com/res/en/pdffiles/doc_search/68000.pdf; .Checked SCH: RF
L1 = L1210R2R2MDWIT: FIXED IND 2.2UH 2A 80 MOHM SMD; Manufacturer: Kemet; Type: Wirewound; Material - Core: Ferrite; Inductance: 2.2µH; Tolerance: ±20%; Shielding: Unshielded; DC Resistance (DCR): 80 mOhm; Frequency - Self Resonant: 190MHz; Frequency - Test: 100kHz; .Creator: MM; .Checked PCB: RF; Supplier 1: Digi-Key; Manufacturer Part Number: L1210R2R2MDWIT; RoHS: RoHS Compliant; Category: Inductors, Coils, Chokes; Stock 1: 3607; Pricing 1: 1=0.52, 10=0.466, 25=0.4372, 50=0.379, 100=0.3499, 250=0.33236, 500=0.30322 (USD); Packaging: Cut Tape (CT); Current Rating: 2A; Current - Saturation: -; Q @ Freq: -; Operating Temperature: -40°C ~ 105°C; Mounting Type: Surface Mount; Package / Case: 1210 (3225 Metric); Size / Dimension: 0.126" L x 0.098" W (3.20mm x 2.50mm); Height - Seated (Max): 0.106" (2.70mm); Supplier Device Package: 1210; ComponentLink1URL: http://www.kemet.com//kemet/web/homepage/kechome.nsf/vapubfile/Ferrite%20Products%20Catalog/$file/F3115.pdf; ComponentLink1Description: http://www.kemet.com//kemet/web/homepage/kechome.nsf/vapubfile/Ferrite%20Products%20Catalog/$file/F3115.pdf; Supplier Part Number 1: 399-9598-1-ND; .Checked SCH: RF
LINK1-LINK3 = QPC02SXGN-RC: CONN JUMPER SHORTING .100" GOLD; Manufacturer: Sullins Connector Solutions; Gender: Female Sockets; Number of Positions or Pins (Grid): 2 (1 x 2); Pitch: 0.100" (2.54mm); .Checked SCH: used; Supplier 1: Digi-Key; Supplier Part Number 1: S9337-ND; Manufacturer Part Number: QPC02SXGN-RC; RoHS: RoHS Compliant; Category: Connectors, Interconnects; Stock 1: 23274; Pricing 1: 1=0.11, 10=0.066, 25=0.0468, 50=0.0384, 100=0.033, 250=0.02792, 500=0.0258, 1000=0.0228, 2500=0.018 (USD); Type: Open Top; Height: 0.235" (5.97mm); Contact Finish: Gold; Contact Finish Thickness: Flash; Color: -; Packaging: Bulk; ComponentLink1URL: http://www.sullinscorp.com/drawings/284_SXGN_11510.pdf; ComponentLink1Description: http://www.sullinscorp.com/drawings/284_SXGN_11510.pdf
R1 = RC0805FR-07100KL: RES SMD 100K OHM 1% 1/8W 0805; Manufacturer: Yageo; Power (Watts): 0.125W, 1/8W; Temperature Coefficient: ±100ppm/°C; .Creator: MM; .Checked PCB: RF; Supplier 1: Digi-Key; Manufacturer Part Number: RC0805FR-07100KL; RoHS: RoHS Compliant; Category: Resistors; Stock 1: 1604881; Pricing 1: 1=0.1, 10=0.021, 25=0.0148, 100=0.0084, 250=0.0064, 500=0.0051, 1000=0.00376, 2500=0.00326 (USD); Packaging: Cut Tape (CT); Resistance (Ohms): 100k; Tolerance: ±1%; Composition: Thick Film; Features: Moisture Resistant; Operating Temperature: -55°C ~ 155°C; Package / Case: 0805 (2012 Metric); Supplier Device Package: 0805; Size / Dimension: 0.079" L x 0.049" W (2.00mm x 1.25mm); Height: 0.024" (0.60mm); Number of Terminations: 2; ComponentLink1URL: http://www.yageo.com/documents/recent/PYu-RC_Group_51_RoHS_L_1.pdf; ComponentLink1Description: http://www.yageo.com/documents/recent/PYu-RC_Group_51_RoHS_L_1.pdf; Supplier Part Number 1: 311-100KCRCT-ND; .Checked SCH: RF
R2 R3 R15 R17 R22 = RC0805FR-07560RL: RES SMD 560 OHM 1% 1/8W 0805; Manufacturer: Yageo; Resistance (Ohms): 560; Power (Watts): 0.125W, 1/8W; Temperature Coefficient: ±100ppm/°C; .Creator: MM; .Checked PCB: RF; Supplier 1: Digi-Key; Manufacturer Part Number: RC0805FR-07560RL; RoHS: RoHS Compliant; Category: Resistors; Stock 1: 53313; Pricing 1: 1=0.1, 10=0.021, 25=0.0148, 100=0.0084, 250=0.0064, 500=0.0051, 1000=0.00376, 2500=0.00326 (USD); Packaging: Cut Tape (CT); Tolerance: ±1%; Composition: Thick Film; Features: Moisture Resistant; Operating Temperature: -55°C ~ 155°C; Package / Case: 0805 (2012 Metric); Supplier Device Package: 0805; Size / Dimension: 0.079" L x 0.049" W (2.00mm x 1.25mm); Height: 0.024" (0.60mm); Number of Terminations: 2; ComponentLink1URL: http://www.yageo.com/documents/recent/PYu-RC_Group_51_RoHS_L_1.pdf; ComponentLink1Description: http://www.yageo.com/documents/recent/PYu-RC_Group_51_RoHS_L_1.pdf; Supplier Part Number 1: 311-560CRCT-ND; .Checked SCH: RF
R4 R14 R18-R21 = RC0805FR-0710KL: RES SMD 10K OHM 1% 1/8W 0805; Manufacturer: Yageo; Power (Watts): 0.125W, 1/8W; Temperature Coefficient: ±100ppm/°C; .Creator: MM; .Checked PCB: RF; Supplier 1: Digi-Key; Manufacturer Part Number: RC0805FR-0710KL; RoHS: RoHS Compliant; Category: Resistors; Stock 1: 4094384; Pricing 1: 1=0.1, 10=0.021, 25=0.0148, 100=0.0084, 250=0.0064, 500=0.0051, 1000=0.00376, 2500=0.00326 (USD); Packaging: Cut Tape (CT); Resistance (Ohms): 10k; Tolerance: ±1%; Composition: Thick Film; Features: Moisture Resistant; Operating Temperature: -55°C ~ 155°C; Package / Case: 0805 (2012 Metric); Supplier Device Package: 0805; Size / Dimension: 0.079" L x 0.049" W (2.00mm x 1.25mm); Height: 0.024" (0.60mm); Number of Terminations: 2; ComponentLink1URL: http://www.yageo.com/documents/recent/PYu-RC_Group_51_RoHS_L_1.pdf; ComponentLink1Description: http://www.yageo.com/documents/recent/PYu-RC_Group_51_RoHS_L_1.pdf; Supplier Part Number 1: 311-10.0KCRCT-ND; .Checked SCH: RF
R5-R7 R13 R23-R25 = RC0805FR-0722RL: RES SMD 22 OHM 1% 1/8W 0805; Manufacturer: Yageo; Resistance (Ohms): 22; Power (Watts): 0.125W, 1/8W; Temperature Coefficient: ±100ppm/°C; .Creator: MM; .Checked PCB: RF; Supplier 1: Digi-Key; Manufacturer Part Number: RC0805FR-0722RL; RoHS: RoHS Compliant; Category: Resistors; Stock 1: 63849; Pricing 1: 1=0.1, 10=0.021, 25=0.0148, 100=0.0084, 250=0.0064, 500=0.0051, 1000=0.00376, 2500=0.00326 (USD); Packaging: Cut Tape (CT); Tolerance: ±1%; Composition: Thick Film; Features: Moisture Resistant; Operating Temperature: -55°C ~ 155°C; Package / Case: 0805 (2012 Metric); Supplier Device Package: 0805; Size / Dimension: 0.079" L x 0.049" W (2.00mm x 1.25mm); Height: 0.024" (0.60mm); Number of Terminations: 2; ComponentLink1URL: http://www.yageo.com/documents/recent/PYu-RC_Group_51_RoHS_L_1.pdf; ComponentLink1Description: http://www.yageo.com/documents/recent/PYu-RC_Group_51_RoHS_L_1.pdf; Supplier Part Number 1: 311-22.0CRCT-ND; .Checked SCH: RF
R8 R26-R28 = RC0805JR-070RL: RES 0.0 OHM 1/8W 0805 SMD; Manufacturer: Yageo; Resistance (Ohms): 0.0; Power (Watts): 0.125W, 1/8W; Tolerance: Jumper; .Checked PCB: RF; Category: Resistors; Supplier Part Number: 311-0.0ARCT-ND; Manufacturer Part Number: RC0805JR-070RL; Package / Case: 0805 (2012 Metric); Price 1k [$]: 0.01479; Value: 0R; .Checked SCH: RF; Supplier: Digikey; Supplier 1: Digi-Key; Supplier Part Number 1: 311-0.0ARCT-ND; RoHS: RoHS Compliant; Stock 1: 933202; Pricing 1: 10=0.017, 50=0.0126, 100=0.0096, 250=0.00716, 500=0.00528, 1000=0.00352 (USD); Composition: Thick Film; Features: -; Temperature Coefficient: -; Size / Dimension: 0.079" L x 0.049" W (2.00mm x 1.25mm); Height: 0.024" (0.60mm); Number of Terminations: 2; Packaging: Cut Tape (CT); ComponentLink1URL: http://www.yageo.com/documents/recent/PYu-RC0805_51_RoHS_L_4.pdf; ComponentLink1Description: http://www.yageo.com/documents/recent/PYu-RC0805_51_RoHS_L_4.pdf
R9 R16 = RC0805FR-071ML: RES SMD 1M OHM 1% 1/8W 0805; Manufacturer: Yageo; Resistance: 1MR; Temperature Coefficient: 100ppm/°C; Power Rating: 125mW; Voltage Rating: 150V; Supplier 1: Digi-Key; Manufacturer Part Number: RC0805FR-071ML; Stock 1: 0; Case/Package: 0805; Case Code (Metric): 2012; Case Code (Imperial): 0805; Min Operating Temperature: -55°C; Max Operating Temperature: 155°C; Tolerance: 1%; Packaging: Tape and Reel; Composition: Thick Film; Package Quantity: 1; Number of Terminations: 2; Termination: SMD/SMT; Military Standard: Not; Max Power Dissipation: 125mW; Features: Moisture Resistant; Length: 0.079inch; Height: 0.024inch; Width: 0.049inch; Depth: 1.25mm; REACH SVHC: Unknown; Lead Free: Lead Free; Supplier Part Number 1: 311-1.00MCRTR-ND
R10-R12 = RC0805FR-071KL: RES SMD 1K OHM 1% 1/8W 0805; Manufacturer: Yageo; Power (Watts): 0.125W, 1/8W; Temperature Coefficient: ±100ppm/°C; .Creator: MM; .Checked PCB: RF; Supplier 1: Digi-Key; Manufacturer Part Number: RC0805FR-071KL; RoHS: RoHS Compliant; Category: Resistors; Stock 1: 3497185; Pricing 1: 1=0.1, 10=0.021, 25=0.0148, 100=0.0084, 250=0.0064, 500=0.0051, 1000=0.00376, 2500=0.00326 (USD); Packaging: Cut Tape (CT); Resistance (Ohms): 1k; Tolerance: ±1%; Composition: Thick Film; Features: Moisture Resistant; Operating Temperature: -55°C ~ 155°C; Package / Case: 0805 (2012 Metric); Supplier Device Package: 0805; Size / Dimension: 0.079" L x 0.049" W (2.00mm x 1.25mm); Height: 0.024" (0.60mm); Number of Terminations: 2; ComponentLink1URL: http://www.yageo.com/documents/recent/PYu-RC_Group_51_RoHS_L_1.pdf; ComponentLink1Description: http://www.yageo.com/documents/recent/PYu-RC_Group_51_RoHS_L_1.pdf; Supplier Part Number 1: 311-1.00KCRCT-ND; .Checked SCH: RF
RV1 RV2 = CG0603MLC-05E: VARISTOR 0603; Manufacturer: Bourns Inc.; Number of Circuits: 1; Maximum DC Volts: 5VDC; .Creator: MM; .Checked PCB: RF; Supplier 1: Digi-Key; Manufacturer Part Number: CG0603MLC-05E; RoHS: RoHS Compliant; Category: Circuit Protection; Stock 1: 104704; Pricing 1: 1=0.19, 10=0.177, 25=0.164, 50=0.158, 100=0.1472, 250=0.13104, 500=0.1092, 1000=0.10348, 2500=0.09256 (USD); Packaging: Cut Tape (CT); Varistor Voltage (Min): -; Varistor Voltage (Typ): -; Varistor Voltage (Max): -; Current - Surge: -; Maximum AC Volts: -; Energy: -; Package / Case: 0603 (1608 Metric); Mounting Type: Surface Mount, MLCV; ComponentLink1URL: http://www.bourns.com/data/global/pdfs/MLC.pdf; ComponentLink1Description: http://www.bourns.com/data/global/pdfs/MLC.pdf; Supplier Part Number 1: CG0603MLC-05ECT-ND; .Checked SCH: RF
S1 S2 = 1825910-6: SWITCH TACTILE SPST-NO 0.05A 24V; Manufacturer: TE Connectivity; Switch Function: Off-Mom; Contact Rating @ Voltage: 0.05A @ 24VDC; Actuator Type: Standard; Actuator Height off PCB, from Pins: 5.00mm; Actuator Orientation: Top Actuated; Outline: 6.00mm x 6.00mm; Illumination: Non-Illuminated; Operating Force: 160gf; Actuator Material: Polybutylene Terephthalate (PBT); Switch Travel: 0.25mm; Mechanical Life: 100,000 Cycles; .Creator: MM; .Checked PCB: RF; Supplier 1: Digi-Key; Manufacturer Part Number: 1825910-6; RoHS: RoHS Compliant; Category: Switches; Stock 1: 181823; Pricing 1: 1=0.1, 10=0.095, 25=0.0912, 50=0.088, 100=0.0831, 250=0.07824, 500=0.07498, 1000=0.05705 (USD); Packaging: Bulk; Circuit: SPST-NO; Mounting Type: Through Hole; Termination Style: PC Pin; Illumination Voltage (Nominal): -; Illumination Type, Color: -; Ingress Protection: -; Features: -; Operating Temperature: -35°C ~ 85°C; ComponentLink1URL: http://www.te.com/commerce/DocumentDelivery/DDEController?Action=srchrtrv&DocNm=1825910&DocType=Customer+Drawing&DocLang=English; ComponentLink1Description: http://www.te.com/commerce/DocumentDelivery/DDEController?Action=srchrtrv&DocNm=1825910&DocType=Customer+Drawing&DocLang=English; Supplier Part Number 1: 450-1650-ND; .Checked SCH: RF
U1 = ATMEGA328P-PU: ATMEL         ATMEGA328P-PU            8 Bit Microcontroller, Low Power High Performance, ATmega, 20 MHz, 32 KB, 2 KB, 28 Pins, DIP; Manufacturer: Microchip / Atmel; Core Architecture: AVR; RAM Size: 2KB; Number of PWM Channels: 6; Number of Timers/Counters: 3; Min Supply Voltage: 1.8V; Max Supply Voltage: 5.5V; Interface: I2C,SPI,UART,USART,2-Wire; Number of I/Os: 23; Frequency: 20MHz; Oscillator Type: Internal; Data Bus Width: 8b; Number of SPI Channels: 1; Watchdog Timer: Yes; Memory Type: FLASH; Memory Size: 32KB; Peripherals: Brown-out Detect/Reset,POR,PWM,WDT; Supplier 1: Digi-Key; Manufacturer Part Number: ATMEGA328P-PU; Stock 1: 14491; Pricing 1: 1=2.14, 25=1.9672, 100=1.7819 (USD); Mount: Through Hole; Case/Package: PDIP; Number of Pins: 28; Contact Plating: Tin,Matte; Min Operating Temperature: -40°C; Max Operating Temperature: 85°C; Package Quantity: 14; Number of ADC Channels: 6; Packaging: Rail/Tube; Number of Programmable I/O: 23; Max Frequency: 20MHz; Number of I2C Channels: 1; Length: 37.4mm; Height: 3.28mm; Width: 6.76mm; Radiation Hardening: No; REACH SVHC: No SVHC; Lead Free: Lead Free; ComponentLink1URL: https://datasheet.ciiva.com/1157/1684409-1157696.pdf; ComponentLink1Description: https://datasheet.ciiva.com/1157/1684409-1157696.pdf; ComponentLink2URL: https://datasheet.ciiva.com/20168/73-4283-20168380.pdf; ComponentLink2Description: https://datasheet.ciiva.com/20168/73-4283-20168380.pdf; ComponentLink3URL: https://datasheet.ciiva.com/15213/getdatasheetpartid-318533-15213133.pdf; ComponentLink3Description: https://datasheet.ciiva.com/15213/getdatasheetpartid-318533-15213133.pdf; ComponentLink4URL: https://datasheet.ciiva.com/19457/2139111-19457070.pdf; ComponentLink4Description: https://datasheet.ciiva.com/19457/2139111-19457070.pdf; ComponentLink5URL: https://datasheet.ciiva.com/26818/atmega328p-pu-26818578.pdf; ComponentLink5Description: https://datasheet.ciiva.com/26818/atmega328p-pu-26818578.pdf; ComponentLink6URL: https://datasheet.ciiva.com/29119/155197-da-01-en-microcontr-atmega328p-pu-8bit-pdip-28-29119593.pdf; ComponentLink6Description: https://datasheet.ciiva.com/29119/155197-da-01-en-microcontr-atmega328p-pu-8bit-pdip-28-29119593.pdf; Supplier Part Number 1: ATMEGA328P-PU-ND
U2 = ATMEGA16U2-AU: ATMEL         ATMEGA16U2-AU            MCU, 8BIT, MEGAAVR, 16MHZ, TQFP-32; Manufacturer: Microchip / Atmel; Core Architecture: AVR; Data Bus Width: 8b; RAM Size: 512B; Interface: SPI,Serial,USB,UART,USART; Number of Timers/Counters: 2; Max Supply Voltage: 5.5V; Min Supply Voltage: 2.7V; Number of Programmable I/O: 22; Watchdog Timer: Yes; Memory Type: FLASH; Memory Size: 16KB; Number of PWM Channels: 5; Oscillator Type: Internal; Number of SPI Channels: 1; Peripherals: Brown-out Detect/Reset,POR,PWM,WDT; Supplier 1: Digi-Key; Manufacturer Part Number: ATMEGA16U2-AU; Stock 1: 4703; Pricing 1: 1=2.52, 25=2.3176, 100=2.1012 (USD); Mount: Surface Mount; Case/Package: A; Number of Pins: 32; Contact Plating: Tin,Matte; Min Operating Temperature: -40°C; Max Operating Temperature: 85°C; Package Quantity: 1250; Frequency: 16MHz; Packaging: Tray; Max Frequency: 16MHz; Number of I/Os: 22; Length: 7mm; Height: 1.05mm; Width: 7mm; REACH SVHC: No SVHC; Lead Free: Lead Free; ComponentLink1URL: https://datasheet.ciiva.com/13036/doc7799-28769-13036800.pdf; ComponentLink1Description: https://datasheet.ciiva.com/13036/doc7799-28769-13036800.pdf; ComponentLink2URL: https://datasheet.ciiva.com/22651/doc7799-22651110.pdf; ComponentLink2Description: https://datasheet.ciiva.com/22651/doc7799-22651110.pdf
U3 = TL1963A-33DCQR: IC REG LDO 3.3V 1.5A SOT223-6; Manufacturer: Texas Instruments; Regulator Topology: Positive Fixed; Voltage - Dropout (Typical): 0.34V @ 1.5A; Number of Regulators: 1; Voltage - Input: Up to 20V; Current - Limit (Min): 1.6A; .Creator: MM; .Checked PCB: RF; Supplier 1: Digi-Key; Manufacturer Part Number: TL1963A-33DCQR; RoHS: RoHS Compliant; Category: Integrated Circuits (ICs); Stock 1: 1690; Pricing 1: 1=3.11, 10=2.786, 25=2.5056, 100=2.2788, 250=2.0628, 500=1.8468, 750=1.674, 1000=1.35 (USD); Packaging: Cut Tape (CT); Voltage - Output: 3.3V; Current - Output: 1.5A; Operating Temperature: -40°C ~ 125°C; Mounting Type: Surface Mount; Package / Case: SOT-223-6; Supplier Device Package: SOT-223-6; ComponentLink1URL: http://www.ti.com/lit/ds/symlink/tl1963a.pdf; ComponentLink1Description: http://www.ti.com/lit/ds/symlink/tl1963a.pdf; Supplier Part Number 1: 296-24534-1-ND; .Checked SCH: RF
U4-U7 = SN74AHC1G09DBVR: IC GATE AND SGL 2INP SOT23-5; Manufacturer: Texas Instruments; Logic Type: AND Gate; Number of Circuits: 1; Number of Inputs: 2; Voltage - Supply: 2 V ~ 5.5 V; Current - Quiescent (Max): 1µA; Current - Output High, Low: -, 8mA; Logic Level - Low: 0.5 V ~ 1.65 V; Logic Level - High: 1.5 V ~ 3.85 V; Max Propagation Delay @ V, Max CL: 7.5ns @ 5V, 50pF; .Creator: MM; .Checked PCB: used; Supplier 1: Digi-Key; Manufacturer Part Number: SN74AHC1G09DBVR; RoHS: RoHS Compliant; Category: Integrated Circuits (ICs); Stock 1: 3468; Pricing 1: 1=0.49, 10=0.345, 25=0.2836, 100=0.2265, 250=0.165, 500=0.134, 1000=0.103 (USD); Features: Open Drain; Operating Temperature: -55°C ~ 125°C; Mounting Type: Surface Mount; Supplier Device Package: SOT-23-5; Package / Case: SC-74A, SOT-753; Packaging: Cut Tape (CT); ComponentLink1URL: http://www.ti.com/lit/ds/symlink/sn74ahc1g09.pdf; ComponentLink1Description: http://www.ti.com/lit/ds/symlink/sn74ahc1g09.pdf; Supplier Part Number 1: 296-29202-1-ND; .Checked SCH: used
Y1 Y2 = ABM7-22.1184MHZ-D2Y-T: Crystals 22.1184MHz 20ppm 18pF -40C+85C; Manufacturer: Abracon; ESR (Equivalent Series Resistance): 50R; Frequency Stability: 30ppm; Supplier 1: Digi-Key; Manufacturer Part Number: ABM7-22.1184MHZ-D2Y-T; Stock 1: 5243; Pricing 1: 1=1, 10=0.886, 50=0.8278, 100=0.7315, 500=0.693 (USD); Mount: Surface Mount; Case/Package: CSMD; Number of Pins: 2; Min Operating Temperature: -40°C; Max Operating Temperature: 85°C; Package Quantity: 1; Packaging: Tape and Reel; Frequency: 22.1184MHz; Frequency Tolerance: 20ppm; Load Capacitance: 18pF; Tolerance: 20ppm; Termination: SMD/SMT; Composition: Ceramic; Length: 6mm; Height: 0.055inch; Width: 0.138inch; Depth: 3.5mm; Radiation Hardening: No; REACH SVHC: Unknown; Lead Free: Lead Free; Supplier Part Number 1: 535-9844-6-ND